# EAGLE design buttonBoard (EAGLE 8.4.3)
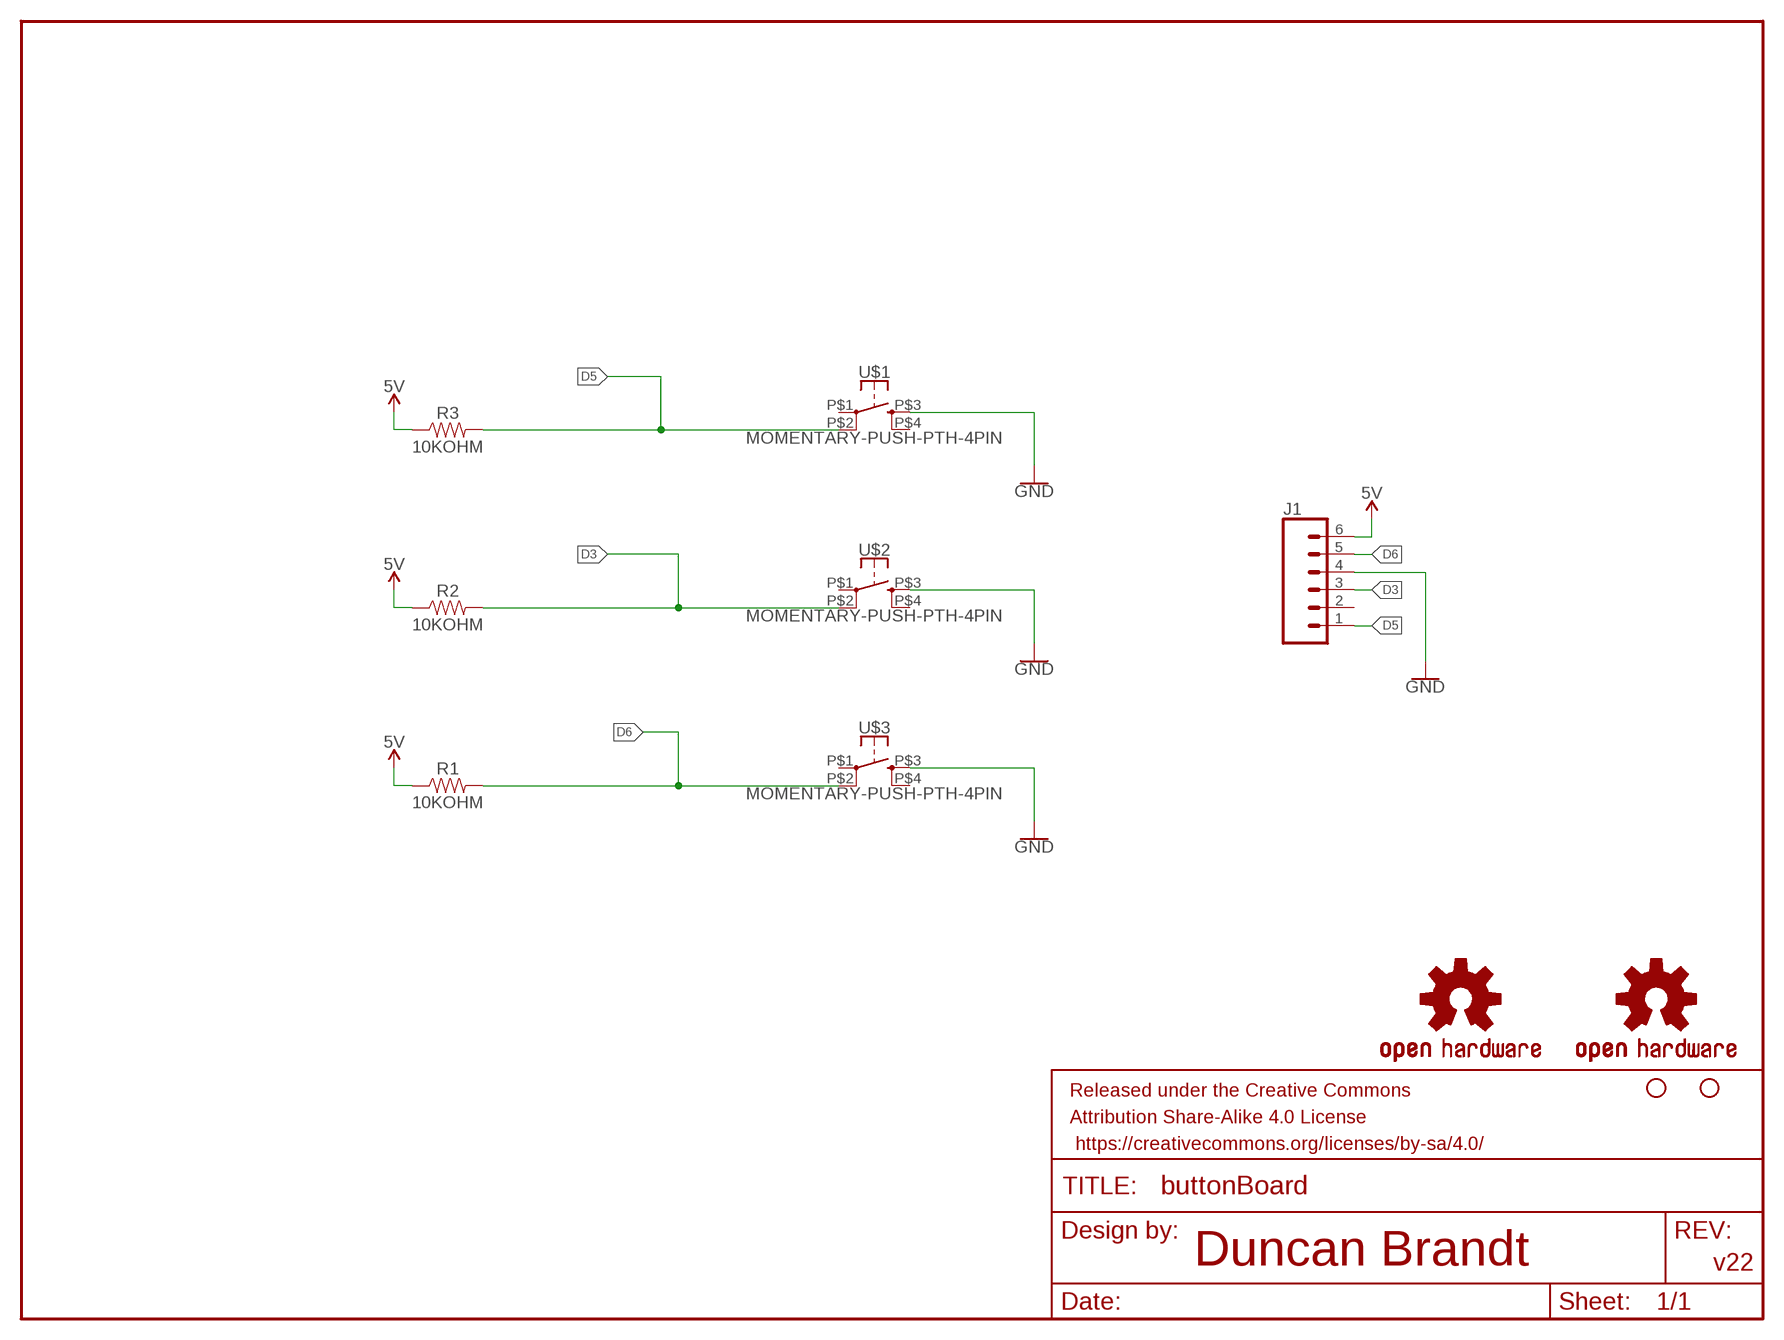
[diagram p0: schematic, sheet 1]

## Parts
FRAME2  FRAME-LETTER  [CREATIVE_COMMONS]
J1  CONN_06SILK_FEMALE_PTH  [1X06]
JP3  STAND-OFF  [STAND-OFF]
JP6  STAND-OFF  [STAND-OFF]
R1  10KOHM  [AXIAL-0.3]
R2  10KOHM  [AXIAL-0.3]
R3  10KOHM  [AXIAL-0.3]
U$1  MOMENTARY-PUSH-PTH-4PIN  [SOFTPUSH_BTN_PTH_0.2INCH]
U$2  MOMENTARY-PUSH-PTH-4PIN  [SOFTPUSH_BTN_PTH_0.2INCH]
U$3  MOMENTARY-PUSH-PTH-4PIN  [SOFTPUSH_BTN_PTH_0.2INCH]
U$4  OSHW-LOGOS  [OSHW-LOGO-S]
U$16  OSHW-LOGOS  [OSHW-LOGO-S]

## Nets
5V: J1.6 R1.P$1 R2.P$1 R3.P$1
D3: J1.3 R2.P$2 U$2.P$2
D5: J1.1 R3.P$2 U$1.P$2
D6: J1.5 R1.P$2 U$3.P$2
GND: J1.4 U$1.P$3 U$2.P$3 U$3.P$3
Unconnected: J1.2 U$1.P$1 U$1.P$4 U$2.P$1 U$2.P$4 U$3.P$1 U$3.P$4

## Notes on the sheet
- Duncan Brandt | v22

## Library data of the parts
FRAME2 = DB-SYMBOLS:FRAME-LETTER: Schematic Frame - Letter Standard 8.5x11 US Letter frame
J1 = DB-CONN:CONN_06: 6 Pin Header Multi connection point. Often used as Generic Header-pin footprint for 0.1 inch spaced/style header connections DB BOARDS: DB Drawing Board <www.dbboards.com>; PROD_ID: CONN-08437
JP3 JP6 = DB-HARDWARE:STAND-OFF: #4 Phillips Hole Screw Hole Mount Hole DB BOARDS: DB Drawing Board <www.dbboards.com>
R1-R3 = DB-RES:10KOHM: 10kΩ Resistor Package: 0603 A resistor is a passive two-terminal electrical component that implements electrical resistance as a circuit element. Resistors act to reduce current flow, and, at the same time, act to lower voltage levels within circuits. - Wikipedia DB BOARDS: DB Drawing Board <www.dbboards.com>
U$1-U$3 = DB-BTNSWTCH:MOMENTARY-PUSH-PTH-4PIN
U$4 U$16 = DB-SYMBOLS:OSHW-LOGO: Open-Source Hardware (OSHW) Logo This logo indicates the piece of hardware it is found on incorporates a OSHW license and/or adheres to the definition of open source hardware found here: http://freedomdefined.org/OSHW

## Net classes
0 default: width 0.152 mm, drill 0.305 mm, clearance 0.152 mm
1 power: width 0.254 mm

## Board
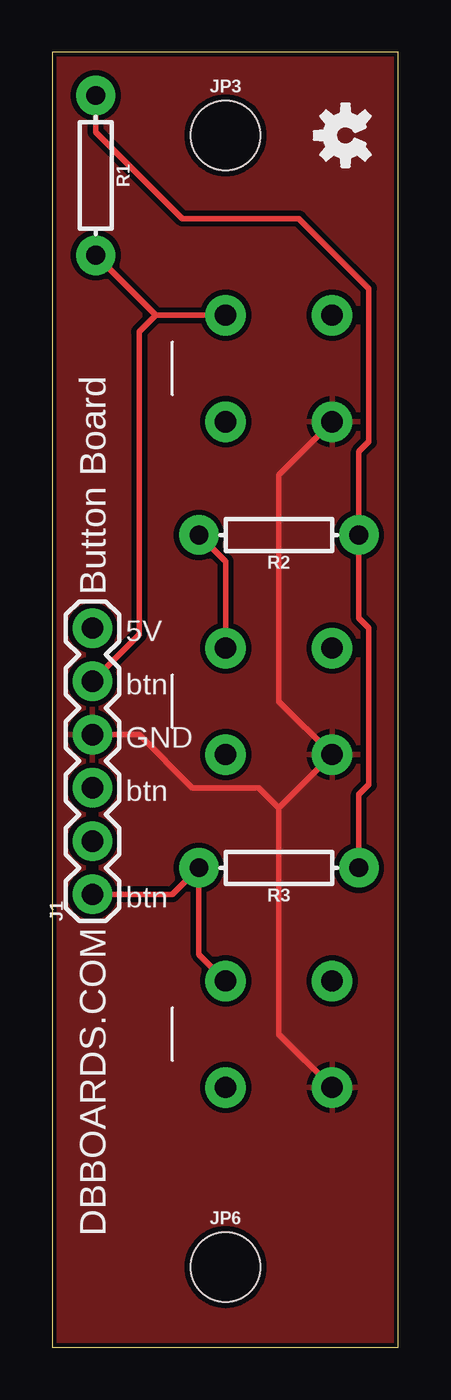
[diagram p1: board, top side]
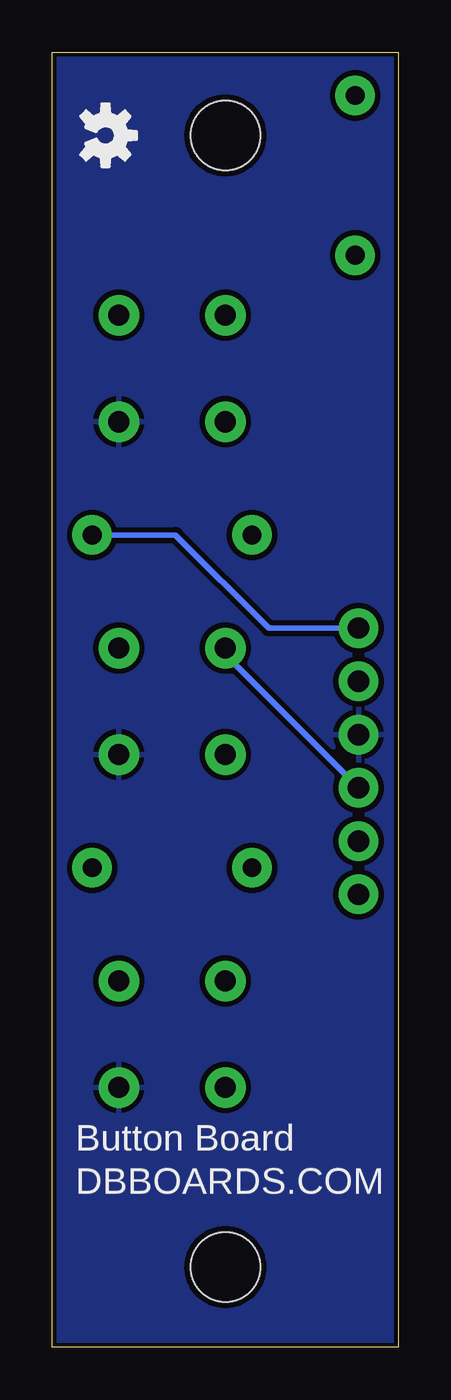
[diagram p2: board, bottom side, seen from below]

Size 16.5 x 61.74 mm. Coordinates in mm from the lower left corner, seen from the top.
Outline: 0,0 16.5,0 16.5,61.74 0,61.74 0,0
Copper layers (1*16): Top 0.035mm / dielectric 1.5mm / Bottom 0.035mm
Design rules "SparkFun-2-layer-STANDARD": minimum track width 10mil, minimum drill 20mil, track to track 10mil, track to pad 8mil, pad to pad 8mil, via to via 10mil, smd to smd 8mil, copper to edge 8mil, drill to drill 8mil, minimum pad ring 10mil, minimum via ring 10mil, stop-mask expansion 4mil, vias tented up to drill 25mil, thermal gap 10mil

### Footprints (pad centres in the part's own frame; a part is rotated, then mirrored left to right if it is on the bottom)
1X06 = drill 1.016 pad 1.88: 1 0,0; 2 2.54,0; 3 5.08,0; 4 7.62,0; 5 10.16,0; 6 12.7,0
STAND-OFF = hole 3.302: 0,0
AXIAL-0.3 = drill 0.9 pad 1.88: P$1 -3.81,0; P$2 3.81,0
SOFTPUSH_BTN_PTH_0.2INCH = drill 1.016 pad 1.93: P$1 2.54,2.54; P$2 -2.54,2.54; P$3 2.54,-2.54; P$4 -2.54,-2.54

### Placement (x,y rotation side)
FRAME2  -101.6,1.27 0 top  (outside the outline)
J1  1.91,21.59 90 top
JP3  8.26,57.78 0 top
JP6  8.26,3.81 0 top
R1  2.06,55.88 270 top
R2  10.79,38.73 180 top
R3  10.79,22.86 180 top
U$1  10.79,14.92 0 top
U$2  10.79,30.8 0 top
U$3  10.79,46.67 0 top
U$4  13.97,57.78 270 bottom
U$16  13.97,57.78 90 top

### Tracks (layer width: path | path; a pad name or v marks a point on that pad's centre or on a via)
5V
  Top 0.254: R3.P$1 14.61,26.35 15.08,26.83 15.08,34.29 14.61,34.77 R2.P$1 14.61,42.7 15.08,43.18 15.08,50.48 11.75,53.82 6.19,53.82 2.06,57.94 R1.P$1
  Bottom 0.254: R2.P$1 10.64,38.73 6.19,34.29 J1.6
D3
  Top 0.254: U$2.P$2 8.26,37.47 R2.P$2
  Bottom 0.254: J1.3 8.26,33.02 U$2.P$2
D5
  Top 0.254: U$1.P$2 6.99,18.73 R3.P$2 5.71,21.59 J1.1
D6
  Top 0.254: R1.P$2 4.92,49.21 | 4.92,49.21 U$3.P$2 | 4.92,49.21 4.13,48.42 4.13,33.97 J1.5
GND
  Top 0.254: U$1.P$3 10.79,14.92 10.79,25.72 | 10.79,25.72 U$2.P$3 10.79,30.8 10.79,41.59 U$3.P$3 | 10.79,25.72 9.84,26.67 6.67,26.67 4.13,29.21 J1.4
  pour Top: 16.51,61.75 0,61.75 0,0 16.51,0
  pour Bottom: 0,61.75 16.51,61.75 16.51,0 0,0

### Text on the board
tPlace: Button Board | 5V | btn | GND | btn | btn | DBBOARDS.COM
bPlace: Button Board | DBBOARDS.COM